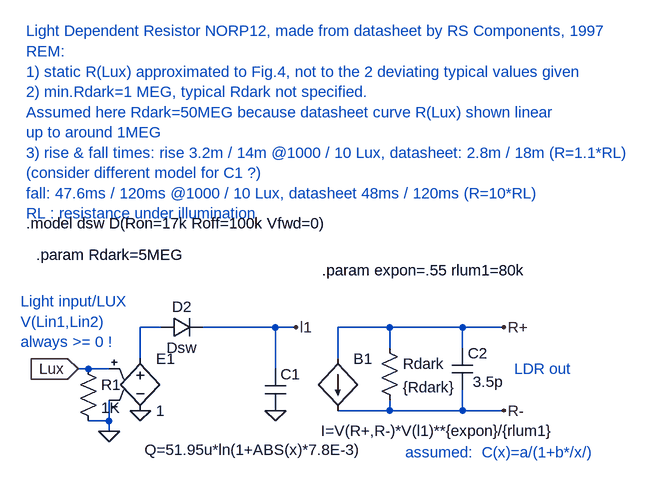
[diagram p0: schematic photoresistor.asc]
photoresistor.asc, the LTspice schematic file:
Version 4
SHEET 1 880 680
WIRE -112 144 -144 144
WIRE 64 144 -48 144
WIRE 96 144 64 144
WIRE 240 144 160 144
WIRE 352 144 240 144
WIRE 416 144 352 144
WIRE 240 176 240 144
WIRE 352 176 352 144
WIRE -144 192 -144 144
WIRE 160 192 160 144
WIRE -224 208 -240 208
WIRE -192 208 -224 208
WIRE 64 208 64 144
WIRE 240 272 240 256
WIRE 240 272 160 272
WIRE 352 272 352 240
WIRE 352 272 240 272
WIRE 416 272 352 272
WIRE -192 288 -192 256
WIRE -192 288 -224 288
WIRE -192 304 -192 288
FLAG -144 272 0
FLAG 96 144 l1
FLAG -240 208 Lux
IOPIN -240 208 In
FLAG 64 272 0
FLAG 416 144 R+
FLAG 416 272 R-
FLAG -192 304 0
SYMBOL bi 160 192 R0
WINDOW 3 -26 111 Left 2
SYMATTR Value I=V(R+,R-)*V(l1)**{expon}/{rlum1}
SYMATTR InstName B1
SYMBOL e -144 176 R0
SYMATTR InstName E1
SYMATTR Value 1
SYMBOL res 224 160 R0
SYMATTR InstName Rdark
SYMATTR Value {Rdark}
SYMBOL cap 48 208 R0
WINDOW 3 -185 124 Left 2
SYMATTR Value Q=51.95u*ln(1+ABS(x)*7.8E-3)
SYMATTR InstName C1
SYMBOL cap 336 176 R0
WINDOW 3 32 52 Left 2
SYMATTR Value 3.5p
SYMATTR InstName C2
SYMBOL diode -112 160 R270
WINDOW 0 32 32 VTop 2
WINDOW 3 0 32 VBottom 2
SYMATTR InstName D2
SYMATTR Value Dsw
SYMBOL res -240 192 R0
SYMATTR InstName R1
SYMATTR Value 1K
TEXT -328 104 Left 2 ;Light input/LUX\nV(Lin1,Lin2)\nalways >= 0 !
TEXT 432 208 Left 2 ;LDR out
TEXT -320 -312 Left 2 ;Light Dependent Resistor NORP12, made from datasheet by RS Components, 1997\nREM:\n1) static R(Lux) approximated to Fig.4, not to the 2 deviating typical values given\n2) min.Rdark=1 MEG, typical Rdark not specified.\nAssumed here Rdark=50MEG because datasheet curve R(Lux) shown linear\nup to around 1MEG\n3) rise & fall times: rise 3.2m / 14m @1000 / 10 Lux, datasheet: 2.8m / 18m (R=1.1*RL)\n(consider different model for C1 ?)\nfall: 47.6ms / 120ms @1000 / 10 Lux, datasheet 48ms / 120ms (R=10*RL)\nRL : resistance under illumination
TEXT -320 -16 Left 2 !.model dsw D(Ron=17k Roff=100k Vfwd=0)
TEXT 264 336 Left 2 ;assumed:  C(x)=a/(1+b*/x/)
TEXT -304 32 Left 2 !.param Rdark=5MEG
TEXT 136 56 Left 2 !.param expon=.55 rlum1=80k

The netlist it stands for:
* photoresistor.asc
B1 R+ R- I=V(R+,R-)*V(l1)**{expon}/{rlum1}
E1 N001 0 Lux 0 1
Rdark R+ R- {Rdark}
C1 l1 0 Q=51.95u*ln(1+ABS(x)*7.8E-3)
C2 R+ R- 3.5p
D2 N001 l1 Dsw
R1 Lux 0 1K
.model D D
.lib standard.dio
* Light input/LUX
* V(Lin1,Lin2)
* always >= 0 !
* LDR out
* Light Dependent Resistor NORP12, made from datasheet by RS Components, 1997
* REM:
* 1) static R(Lux) approximated to Fig.4, not to the 2 deviating typical values given
* 2) min.Rdark=1 MEG, typical Rdark not specified.
* Assumed here Rdark=50MEG because datasheet curve R(Lux) shown linear
* up to around 1MEG
* 3) rise & fall times: rise 3.2m / 14m @1000 / 10 Lux, datasheet: 2.8m / 18m (R=1.1*RL)
* (consider different model for C1 ?)
* fall: 47.6ms / 120ms @1000 / 10 Lux, datasheet 48ms / 120ms (R=10*RL)
* RL : resistance under illumination
.model dsw D(Ron=17k Roff=100k Vfwd=0)
* assumed:  C(x)=a/(1+b*/x/)
.param Rdark=5MEG
.param expon=.55 rlum1=80k
.backanno
.end